# EAGLE schematic serial-header (EAGLE 6.4)
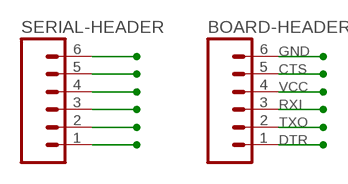
[diagram p0: schematic, sheet 1]

## Parts
BOARD-HEADER  M06LONGPADS  [1X06_LONGPADS]
SERIAL-HEADER  M06SMD  [1X06-SMD]

## Nets
DTR: BOARD-HEADER.1 SERIAL-HEADER.1
GND: BOARD-HEADER.5 BOARD-HEADER.6 SERIAL-HEADER.5 SERIAL-HEADER.6
RXI: BOARD-HEADER.2 SERIAL-HEADER.3
TXO: BOARD-HEADER.3 SERIAL-HEADER.2
VCC_DNU: BOARD-HEADER.4 SERIAL-HEADER.4

## Notes on the sheet
- GND
- CTS
- VCC
- RXI
- TXO
- DTR

## Library data of the parts
BOARD-HEADER SERIAL-HEADER = SparkFun-Connectors:M06: Header 6 Standard 6-pin 0.1" header. Use with straight break away headers (SKU : PRT-00116), right angle break away headers (PRT-00553), swiss pins (PRT-00743), machine pins (PRT-00117), and female headers (PRT-00115). Molex polarized connector foot print use with SKU : PRT-08094 with associated crimp pins and housings. NOTES ON THE VARIANTS LOCK and LOCK_LONGPADS... This footprint was designed to help hold the alignment of a through-hole component (i.e. 6-pin header) while soldering it into place. You may notice that each hole has been shifted either up or down by 0.005 of an inch from it's more standard position (which is a perfectly straight line). This slight alteration caused the pins (the squares in the middle) to touch the edges of the holes. Because they are alternating, it causes a "brace" to hold the component in place. 0.005 has proven to be the perfect amount of "off-center" position when using our standard breakaway headers. Although looks a little odd when you look at the bare footprint, once you have a header in there, the alteration is very hard to notice. Also,if you push a header all the way into place, it is covered up entirely on the bottom side. This idea of altering the position of holes to aid alignment will be further integrated into the Sparkfun Library for other footprints. It can help hold any component with 3 or more connection pins.